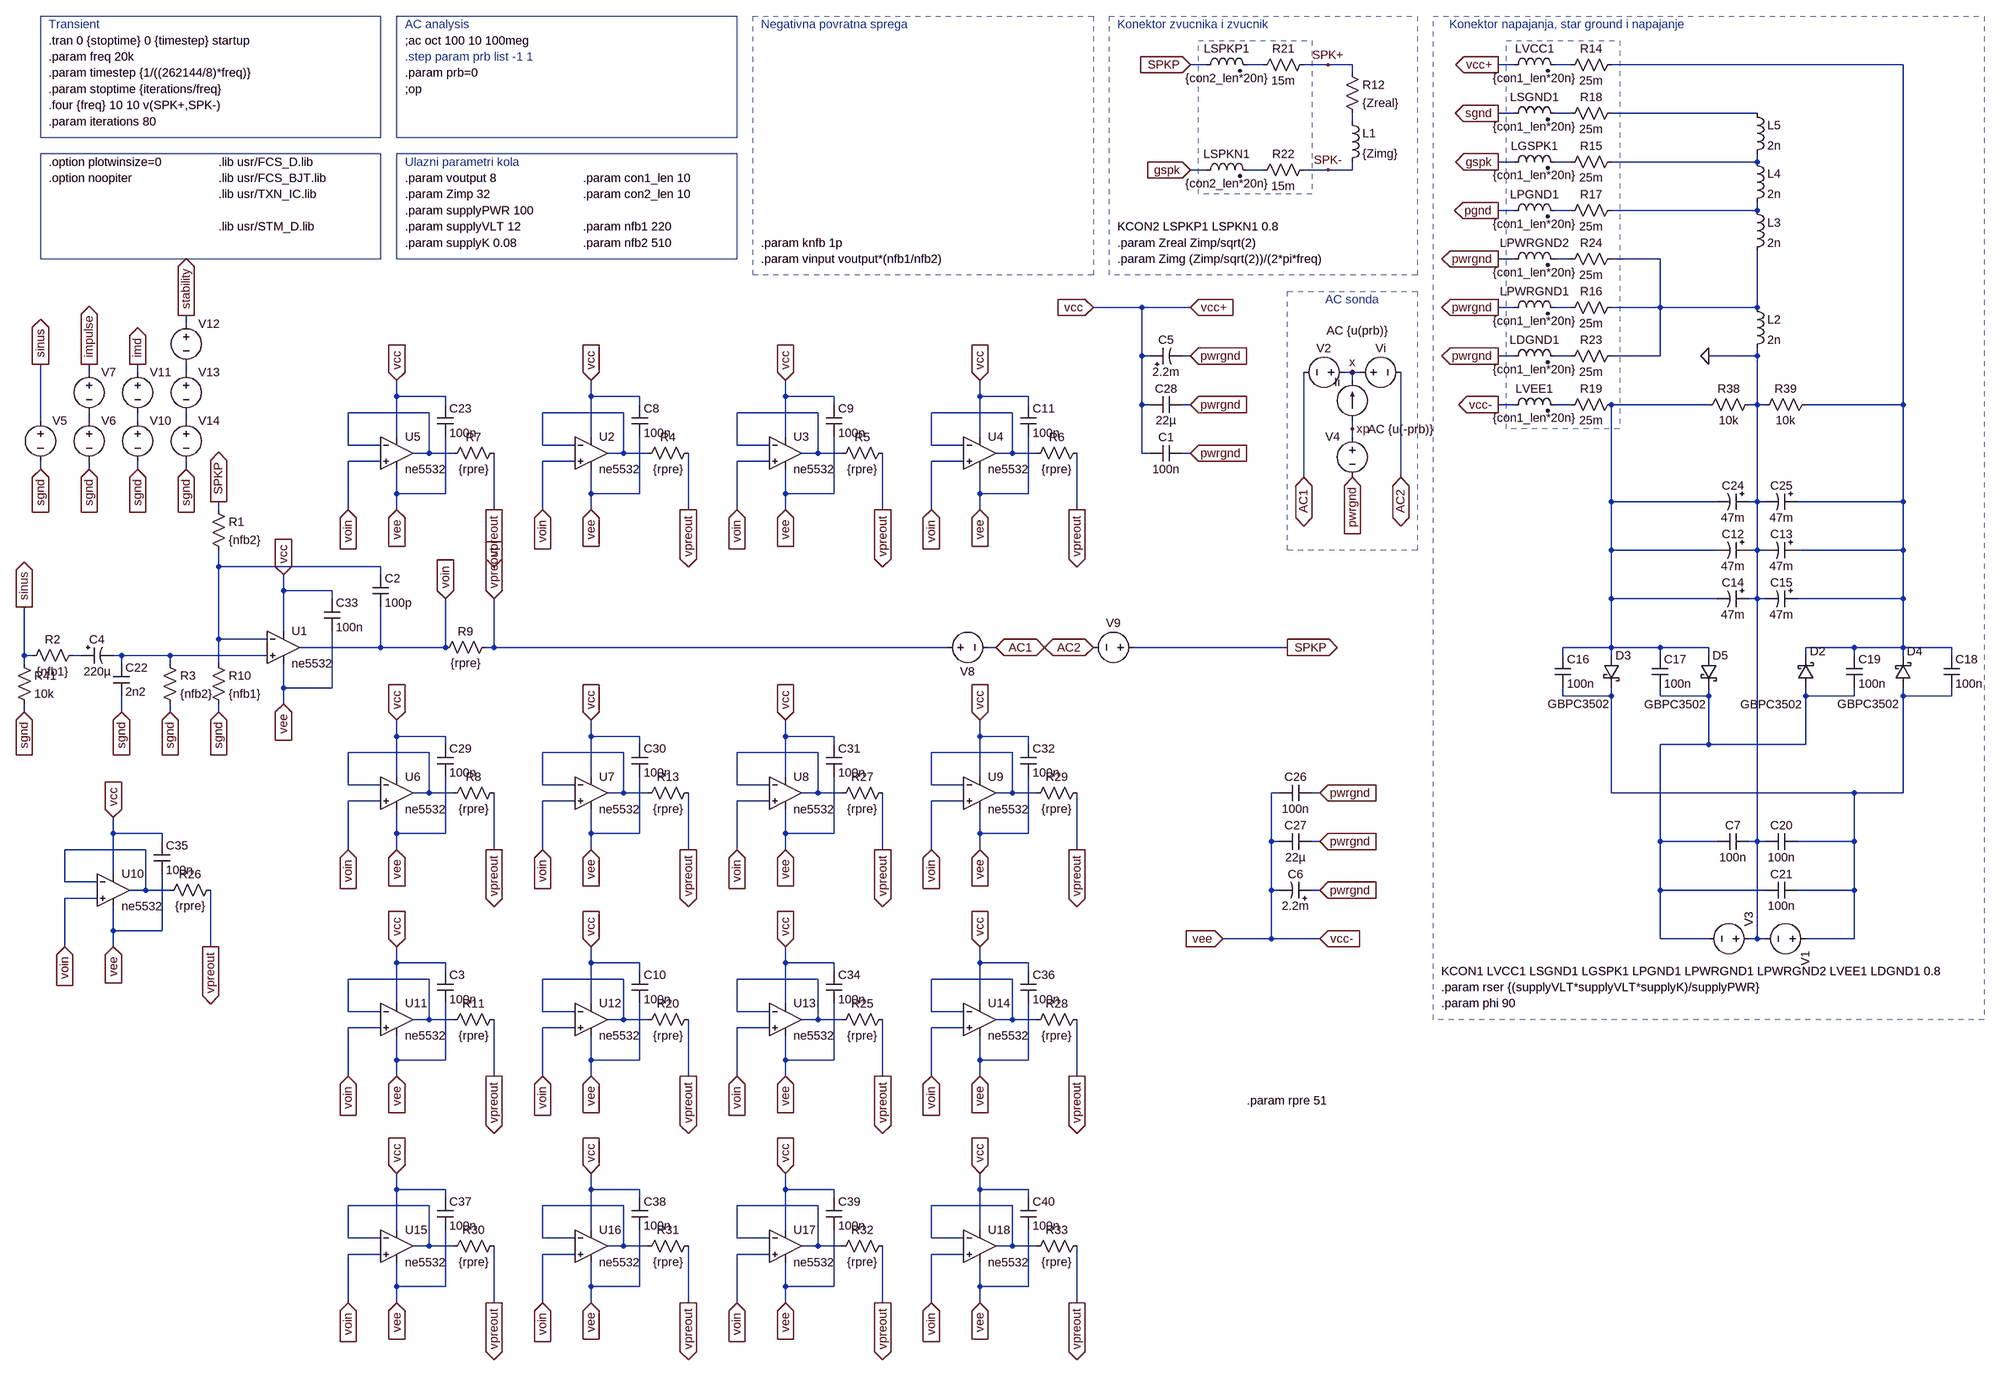
[diagram p0: schematic micro.asc]
micro.asc, the LTspice schematic file:
Version 4
SHEET 1 3028 3024
WIRE 1440 288 1408 288
WIRE 1552 288 1520 288
WIRE 1680 288 1632 288
WIRE 1728 288 1680 288
WIRE 2048 288 2016 288
WIRE 2160 288 2128 288
WIRE 2816 288 2240 288
WIRE 1728 304 1728 288
WIRE 2048 384 2016 384
WIRE 2160 384 2128 384
WIRE 2528 384 2240 384
WIRE 1728 400 1728 384
WIRE 2048 480 2016 480
WIRE 2160 480 2128 480
WIRE 2528 480 2528 464
WIRE 2528 480 2240 480
WIRE 1440 496 1408 496
WIRE 1552 496 1520 496
WIRE 1680 496 1632 496
WIRE 1728 496 1728 480
WIRE 1728 496 1680 496
WIRE 2048 576 2016 576
WIRE 2160 576 2128 576
WIRE 2528 576 2528 560
WIRE 2528 576 2240 576
WIRE 2048 672 2016 672
WIRE 2160 672 2128 672
WIRE 2336 672 2240 672
WIRE 1312 768 1216 768
WIRE 1408 768 1312 768
WIRE 2048 768 2016 768
WIRE 2160 768 2128 768
WIRE 2336 768 2336 672
WIRE 2336 768 2240 768
WIRE 2528 768 2528 656
WIRE 2528 768 2336 768
WIRE -576 800 -576 784
WIRE 1312 864 1312 768
WIRE 1328 864 1312 864
WIRE 1408 864 1392 864
WIRE 2048 864 2016 864
WIRE 2160 864 2128 864
WIRE 2336 864 2336 768
WIRE 2336 864 2240 864
WIRE 2528 864 2528 848
WIRE 2528 864 2432 864
WIRE -768 896 -768 880
WIRE -672 896 -672 880
WIRE -576 896 -576 880
WIRE 1728 896 1712 896
WIRE 1744 896 1728 896
WIRE 1728 912 1728 896
WIRE -160 944 -160 912
WIRE -64 944 -160 944
WIRE 224 944 224 912
WIRE 320 944 224 944
WIRE 608 944 608 912
WIRE 704 944 608 944
WIRE 992 944 992 912
WIRE 1088 944 992 944
WIRE -64 960 -64 944
WIRE 320 960 320 944
WIRE 704 960 704 944
WIRE 1088 960 1088 944
WIRE 1312 960 1312 864
WIRE 1328 960 1312 960
WIRE 1408 960 1392 960
WIRE 2048 960 2016 960
WIRE 2160 960 2128 960
WIRE 2432 960 2240 960
WIRE 2528 960 2528 864
WIRE 2528 960 2512 960
WIRE 2544 960 2528 960
WIRE 2816 960 2816 288
WIRE 2816 960 2624 960
WIRE -96 976 -256 976
WIRE 288 976 128 976
WIRE 672 976 512 976
WIRE 1056 976 896 976
WIRE -864 992 -864 880
WIRE -768 992 -768 976
WIRE -672 992 -672 976
WIRE -576 992 -576 976
WIRE 1728 1008 1728 992
WIRE -160 1024 -160 944
WIRE 224 1024 224 944
WIRE 608 1024 608 944
WIRE 992 1024 992 944
WIRE 1728 1024 1728 1008
WIRE -256 1040 -256 976
WIRE -192 1040 -256 1040
WIRE 128 1040 128 976
WIRE 192 1040 128 1040
WIRE 512 1040 512 976
WIRE 576 1040 512 1040
WIRE 896 1040 896 976
WIRE 960 1040 896 1040
WIRE -96 1056 -96 976
WIRE -96 1056 -128 1056
WIRE -48 1056 -96 1056
WIRE 288 1056 288 976
WIRE 288 1056 256 1056
WIRE 336 1056 288 1056
WIRE 672 1056 672 976
WIRE 672 1056 640 1056
WIRE 720 1056 672 1056
WIRE 1056 1056 1056 976
WIRE 1056 1056 1024 1056
WIRE 1104 1056 1056 1056
WIRE 1312 1056 1312 960
WIRE 1328 1056 1312 1056
WIRE 1408 1056 1392 1056
WIRE -192 1072 -256 1072
WIRE 192 1072 128 1072
WIRE 576 1072 512 1072
WIRE 960 1072 896 1072
WIRE -864 1088 -864 1072
WIRE -768 1088 -768 1072
WIRE -672 1088 -672 1072
WIRE -576 1088 -576 1072
WIRE 1632 1104 1632 896
WIRE 1824 1104 1824 896
WIRE -160 1136 -160 1088
WIRE -64 1136 -64 1024
WIRE -64 1136 -160 1136
WIRE 224 1136 224 1088
WIRE 320 1136 320 1024
WIRE 320 1136 224 1136
WIRE 608 1136 608 1088
WIRE 704 1136 704 1024
WIRE 704 1136 608 1136
WIRE 992 1136 992 1088
WIRE 1088 1136 1088 1024
WIRE 1088 1136 992 1136
WIRE 2240 1152 2240 960
WIRE 2448 1152 2240 1152
WIRE 2528 1152 2528 960
WIRE 2528 1152 2512 1152
WIRE 2544 1152 2528 1152
WIRE 2816 1152 2816 960
WIRE 2816 1152 2608 1152
WIRE -512 1168 -512 1152
WIRE -256 1168 -256 1072
WIRE -160 1168 -160 1136
WIRE 32 1168 32 1056
WIRE 128 1168 128 1072
WIRE 224 1168 224 1136
WIRE 416 1168 416 1056
WIRE 512 1168 512 1072
WIRE 608 1168 608 1136
WIRE 800 1168 800 1056
WIRE 896 1168 896 1072
WIRE 992 1168 992 1136
WIRE 1184 1168 1184 1056
WIRE 2240 1248 2240 1152
WIRE 2448 1248 2240 1248
WIRE 2528 1248 2528 1152
WIRE 2528 1248 2512 1248
WIRE 2544 1248 2528 1248
WIRE 2816 1248 2816 1152
WIRE 2816 1248 2608 1248
WIRE -512 1280 -512 1248
WIRE -192 1280 -512 1280
WIRE -192 1296 -192 1280
WIRE -384 1328 -384 1296
WIRE -288 1328 -384 1328
WIRE -288 1344 -288 1328
WIRE 2240 1344 2240 1248
WIRE 2448 1344 2240 1344
WIRE 2528 1344 2528 1248
WIRE 2528 1344 2512 1344
WIRE 2544 1344 2528 1344
WIRE 2816 1344 2816 1248
WIRE 2816 1344 2608 1344
WIRE -384 1408 -384 1328
WIRE -512 1424 -512 1280
WIRE -416 1424 -512 1424
WIRE -192 1440 -192 1360
WIRE -192 1440 -352 1440
WIRE -64 1440 -64 1344
WIRE -64 1440 -192 1440
WIRE 32 1440 32 1344
WIRE 32 1440 16 1440
WIRE 896 1440 32 1440
WIRE 928 1440 896 1440
WIRE 1024 1440 1008 1440
WIRE 1600 1440 1296 1440
WIRE 2240 1440 2240 1344
WIRE 2240 1440 2144 1440
WIRE 2336 1440 2240 1440
WIRE 2432 1440 2336 1440
WIRE 2720 1440 2624 1440
WIRE 2816 1440 2816 1344
WIRE 2816 1440 2720 1440
WIRE 2912 1440 2816 1440
WIRE -896 1456 -896 1360
WIRE -880 1456 -896 1456
WIRE -784 1456 -800 1456
WIRE -704 1456 -720 1456
WIRE -608 1456 -704 1456
WIRE -416 1456 -608 1456
WIRE 2144 1456 2144 1440
WIRE 2240 1456 2240 1440
WIRE 2336 1456 2336 1440
WIRE 2432 1456 2432 1440
WIRE 2624 1456 2624 1440
WIRE 2720 1456 2720 1440
WIRE 2816 1456 2816 1440
WIRE 2912 1456 2912 1440
WIRE -896 1472 -896 1456
WIRE -704 1472 -704 1456
WIRE -608 1472 -608 1456
WIRE -512 1472 -512 1424
WIRE -384 1520 -384 1472
WIRE -288 1520 -288 1408
WIRE -288 1520 -384 1520
WIRE 2144 1536 2144 1520
WIRE 2240 1536 2240 1520
WIRE 2240 1536 2144 1536
WIRE 2336 1536 2336 1520
WIRE 2432 1536 2432 1520
WIRE 2432 1536 2336 1536
WIRE 2624 1536 2624 1520
WIRE 2720 1536 2720 1520
WIRE 2720 1536 2624 1536
WIRE 2816 1536 2816 1520
WIRE 2912 1536 2912 1520
WIRE 2912 1536 2816 1536
WIRE -384 1552 -384 1520
WIRE -896 1568 -896 1552
WIRE -704 1568 -704 1536
WIRE -608 1568 -608 1552
WIRE -512 1568 -512 1552
WIRE -160 1616 -160 1584
WIRE -64 1616 -160 1616
WIRE 224 1616 224 1584
WIRE 320 1616 224 1616
WIRE 608 1616 608 1584
WIRE 704 1616 608 1616
WIRE 992 1616 992 1584
WIRE 1088 1616 992 1616
WIRE -64 1632 -64 1616
WIRE 320 1632 320 1616
WIRE 704 1632 704 1616
WIRE 1088 1632 1088 1616
WIRE 2432 1632 2432 1536
WIRE 2432 1632 2336 1632
WIRE 2624 1632 2624 1536
WIRE 2624 1632 2432 1632
WIRE -96 1648 -256 1648
WIRE 288 1648 128 1648
WIRE 672 1648 512 1648
WIRE 1056 1648 896 1648
WIRE -160 1696 -160 1616
WIRE 224 1696 224 1616
WIRE 608 1696 608 1616
WIRE 992 1696 992 1616
WIRE -256 1712 -256 1648
WIRE -192 1712 -256 1712
WIRE 128 1712 128 1648
WIRE 192 1712 128 1712
WIRE 512 1712 512 1648
WIRE 576 1712 512 1712
WIRE 896 1712 896 1648
WIRE 960 1712 896 1712
WIRE -96 1728 -96 1648
WIRE -96 1728 -128 1728
WIRE -48 1728 -96 1728
WIRE 288 1728 288 1648
WIRE 288 1728 256 1728
WIRE 336 1728 288 1728
WIRE 672 1728 672 1648
WIRE 672 1728 640 1728
WIRE 720 1728 672 1728
WIRE 1056 1728 1056 1648
WIRE 1056 1728 1024 1728
WIRE 1104 1728 1056 1728
WIRE 1584 1728 1568 1728
WIRE 1664 1728 1648 1728
WIRE 2240 1728 2240 1536
WIRE 2720 1728 2240 1728
WIRE 2816 1728 2816 1536
WIRE 2816 1728 2720 1728
WIRE -192 1744 -256 1744
WIRE 192 1744 128 1744
WIRE 576 1744 512 1744
WIRE 960 1744 896 1744
WIRE -720 1808 -720 1776
WIRE -624 1808 -720 1808
WIRE -160 1808 -160 1760
WIRE -64 1808 -64 1696
WIRE -64 1808 -160 1808
WIRE 224 1808 224 1760
WIRE 320 1808 320 1696
WIRE 320 1808 224 1808
WIRE 608 1808 608 1760
WIRE 704 1808 704 1696
WIRE 704 1808 608 1808
WIRE 992 1808 992 1760
WIRE 1088 1808 1088 1696
WIRE 1088 1808 992 1808
WIRE -624 1824 -624 1808
WIRE 1568 1824 1568 1728
WIRE 1584 1824 1568 1824
WIRE 1664 1824 1648 1824
WIRE 2336 1824 2336 1632
WIRE 2448 1824 2336 1824
WIRE 2528 1824 2528 1344
WIRE 2528 1824 2512 1824
WIRE 2544 1824 2528 1824
WIRE 2720 1824 2720 1728
WIRE 2720 1824 2608 1824
WIRE -656 1840 -816 1840
WIRE -256 1840 -256 1744
WIRE -160 1840 -160 1808
WIRE 32 1840 32 1728
WIRE 128 1840 128 1744
WIRE 224 1840 224 1808
WIRE 416 1840 416 1728
WIRE 512 1840 512 1744
WIRE 608 1840 608 1808
WIRE 800 1840 800 1728
WIRE 896 1840 896 1744
WIRE 992 1840 992 1808
WIRE 1184 1840 1184 1728
WIRE -720 1888 -720 1808
WIRE -816 1904 -816 1840
WIRE -752 1904 -816 1904
WIRE -656 1920 -656 1840
WIRE -656 1920 -688 1920
WIRE -608 1920 -656 1920
WIRE 1568 1920 1568 1824
WIRE 1584 1920 1568 1920
WIRE 1664 1920 1648 1920
WIRE 2336 1920 2336 1824
WIRE 2544 1920 2336 1920
WIRE 2720 1920 2720 1824
WIRE 2720 1920 2608 1920
WIRE -752 1936 -816 1936
WIRE -720 2000 -720 1952
WIRE -624 2000 -624 1888
WIRE -624 2000 -720 2000
WIRE 1568 2016 1568 1920
WIRE 1568 2016 1472 2016
WIRE 1664 2016 1568 2016
WIRE 2336 2016 2336 1920
WIRE 2432 2016 2336 2016
WIRE 2528 2016 2528 1824
WIRE 2528 2016 2512 2016
WIRE 2544 2016 2528 2016
WIRE 2720 2016 2720 1920
WIRE 2720 2016 2624 2016
WIRE -816 2032 -816 1936
WIRE -720 2032 -720 2000
WIRE -528 2032 -528 1920
WIRE -160 2064 -160 2032
WIRE -64 2064 -160 2064
WIRE 224 2064 224 2032
WIRE 320 2064 224 2064
WIRE 608 2064 608 2032
WIRE 704 2064 608 2064
WIRE 992 2064 992 2032
WIRE 1088 2064 992 2064
WIRE -64 2080 -64 2064
WIRE 320 2080 320 2064
WIRE 704 2080 704 2064
WIRE 1088 2080 1088 2064
WIRE -96 2096 -256 2096
WIRE 288 2096 128 2096
WIRE 672 2096 512 2096
WIRE 1056 2096 896 2096
WIRE -160 2144 -160 2064
WIRE 224 2144 224 2064
WIRE 608 2144 608 2064
WIRE 992 2144 992 2064
WIRE -256 2160 -256 2096
WIRE -192 2160 -256 2160
WIRE 128 2160 128 2096
WIRE 192 2160 128 2160
WIRE 512 2160 512 2096
WIRE 576 2160 512 2160
WIRE 896 2160 896 2096
WIRE 960 2160 896 2160
WIRE -96 2176 -96 2096
WIRE -96 2176 -128 2176
WIRE -48 2176 -96 2176
WIRE 288 2176 288 2096
WIRE 288 2176 256 2176
WIRE 336 2176 288 2176
WIRE 672 2176 672 2096
WIRE 672 2176 640 2176
WIRE 720 2176 672 2176
WIRE 1056 2176 1056 2096
WIRE 1056 2176 1024 2176
WIRE 1104 2176 1056 2176
WIRE -192 2192 -256 2192
WIRE 192 2192 128 2192
WIRE 576 2192 512 2192
WIRE 960 2192 896 2192
WIRE -160 2256 -160 2208
WIRE -64 2256 -64 2144
WIRE -64 2256 -160 2256
WIRE 224 2256 224 2208
WIRE 320 2256 320 2144
WIRE 320 2256 224 2256
WIRE 608 2256 608 2208
WIRE 704 2256 704 2144
WIRE 704 2256 608 2256
WIRE 992 2256 992 2208
WIRE 1088 2256 1088 2144
WIRE 1088 2256 992 2256
WIRE -256 2288 -256 2192
WIRE -160 2288 -160 2256
WIRE 32 2288 32 2176
WIRE 128 2288 128 2192
WIRE 224 2288 224 2256
WIRE 416 2288 416 2176
WIRE 512 2288 512 2192
WIRE 608 2288 608 2256
WIRE 800 2288 800 2176
WIRE 896 2288 896 2192
WIRE 992 2288 992 2256
WIRE 1184 2288 1184 2176
WIRE -160 2512 -160 2480
WIRE -64 2512 -160 2512
WIRE 224 2512 224 2480
WIRE 320 2512 224 2512
WIRE 608 2512 608 2480
WIRE 704 2512 608 2512
WIRE 992 2512 992 2480
WIRE 1088 2512 992 2512
WIRE -64 2528 -64 2512
WIRE 320 2528 320 2512
WIRE 704 2528 704 2512
WIRE 1088 2528 1088 2512
WIRE -96 2544 -256 2544
WIRE 288 2544 128 2544
WIRE 672 2544 512 2544
WIRE 1056 2544 896 2544
WIRE -160 2592 -160 2512
WIRE 224 2592 224 2512
WIRE 608 2592 608 2512
WIRE 992 2592 992 2512
WIRE -256 2608 -256 2544
WIRE -192 2608 -256 2608
WIRE 128 2608 128 2544
WIRE 192 2608 128 2608
WIRE 512 2608 512 2544
WIRE 576 2608 512 2608
WIRE 896 2608 896 2544
WIRE 960 2608 896 2608
WIRE -96 2624 -96 2544
WIRE -96 2624 -128 2624
WIRE -48 2624 -96 2624
WIRE 288 2624 288 2544
WIRE 288 2624 256 2624
WIRE 336 2624 288 2624
WIRE 672 2624 672 2544
WIRE 672 2624 640 2624
WIRE 720 2624 672 2624
WIRE 1056 2624 1056 2544
WIRE 1056 2624 1024 2624
WIRE 1104 2624 1056 2624
WIRE -192 2640 -256 2640
WIRE 192 2640 128 2640
WIRE 576 2640 512 2640
WIRE 960 2640 896 2640
WIRE -160 2704 -160 2656
WIRE -64 2704 -64 2592
WIRE -64 2704 -160 2704
WIRE 224 2704 224 2656
WIRE 320 2704 320 2592
WIRE 320 2704 224 2704
WIRE 608 2704 608 2656
WIRE 704 2704 704 2592
WIRE 704 2704 608 2704
WIRE 992 2704 992 2656
WIRE 1088 2704 1088 2592
WIRE 1088 2704 992 2704
WIRE -256 2736 -256 2640
WIRE -160 2736 -160 2704
WIRE 32 2736 32 2624
WIRE 128 2736 128 2640
WIRE 224 2736 224 2704
WIRE 416 2736 416 2624
WIRE 512 2736 512 2640
WIRE 608 2736 608 2704
WIRE 800 2736 800 2624
WIRE 896 2736 896 2640
WIRE 992 2736 992 2704
WIRE 1184 2736 1184 2624
FLAG 1408 768 vcc+
IOPIN 1408 768 In
FLAG 1728 896 x
FLAG 1664 2016 vcc-
IOPIN 1664 2016 In
FLAG 1728 1008 xp
FLAG -704 1568 sgnd
IOPIN -704 1568 In
FLAG -608 1568 sgnd
IOPIN -608 1568 In
FLAG 1408 864 pwrgnd
IOPIN 1408 864 In
FLAG -864 1088 sgnd
IOPIN -864 1088 In
FLAG -864 880 sinus
IOPIN -864 880 Out
FLAG 1664 1920 pwrgnd
IOPIN 1664 1920 In
FLAG 2016 288 vcc+
IOPIN 2016 288 Out
FLAG 2016 960 vcc-
IOPIN 2016 960 Out
FLAG 2016 480 gspk
IOPIN 2016 480 Out
FLAG 2016 768 pwrgnd
IOPIN 2016 768 Out
FLAG 2016 576 pgnd
IOPIN 2016 576 Out
FLAG 2016 384 sgnd
IOPIN 2016 384 Out
FLAG 1600 1440 SPKP
IOPIN 1600 1440 Out
FLAG 1408 496 gspk
IOPIN 1408 496 In
FLAG 1408 288 SPKP
IOPIN 1408 288 In
FLAG 2016 672 pwrgnd
IOPIN 2016 672 Out
FLAG -768 880 impulse
IOPIN -768 880 Out
FLAG 2016 864 pwrgnd
IOPIN 2016 864 Out
FLAG 2432 864 0
FLAG 1632 1104 AC1
IOPIN 1632 1104 BiDir
FLAG 1824 1104 AC2
IOPIN 1824 1104 BiDir
FLAG 1024 1440 AC1
IOPIN 1024 1440 BiDir
FLAG 1216 1440 AC2
IOPIN 1216 1440 BiDir
FLAG 1728 1104 pwrgnd
IOPIN 1728 1104 In
FLAG 1680 288 SPK+
FLAG 1680 496 SPK-
FLAG -672 880 imd
IOPIN -672 880 Out
FLAG 1408 1056 pwrgnd
IOPIN 1408 1056 In
FLAG 1664 1728 pwrgnd
IOPIN 1664 1728 In
FLAG -768 1088 sgnd
IOPIN -768 1088 In
FLAG -672 1088 sgnd
IOPIN -672 1088 In
FLAG -896 1568 sgnd
IOPIN -896 1568 In
FLAG 1664 1824 pwrgnd
IOPIN 1664 1824 In
FLAG 1408 960 pwrgnd
IOPIN 1408 960 In
FLAG -576 784 stability
IOPIN -576 784 Out
FLAG -576 1088 sgnd
IOPIN -576 1088 In
FLAG 1216 768 vcc
IOPIN 1216 768 In
FLAG 1472 2016 vee
IOPIN 1472 2016 In
FLAG -160 912 vcc
IOPIN -160 912 In
FLAG -160 1168 vee
IOPIN -160 1168 In
FLAG -256 1168 voin
IOPIN -256 1168 In
FLAG 32 1168 vpreout
IOPIN 32 1168 Out
FLAG 32 1344 vpreout
IOPIN 32 1344 In
FLAG -64 1344 voin
IOPIN -64 1344 In
FLAG -384 1296 vcc
IOPIN -384 1296 In
FLAG -384 1552 vee
IOPIN -384 1552 In
FLAG 224 912 vcc
IOPIN 224 912 In
FLAG 224 1168 vee
IOPIN 224 1168 In
FLAG 128 1168 voin
IOPIN 128 1168 In
FLAG 416 1168 vpreout
IOPIN 416 1168 Out
FLAG 608 912 vcc
IOPIN 608 912 In
FLAG 608 1168 vee
IOPIN 608 1168 In
FLAG 512 1168 voin
IOPIN 512 1168 In
FLAG 800 1168 vpreout
IOPIN 800 1168 Out
FLAG 992 912 vcc
IOPIN 992 912 In
FLAG 992 1168 vee
IOPIN 992 1168 In
FLAG 896 1168 voin
IOPIN 896 1168 In
FLAG 1184 1168 vpreout
IOPIN 1184 1168 Out
FLAG -160 1584 vcc
IOPIN -160 1584 In
FLAG -160 1840 vee
IOPIN -160 1840 In
FLAG -256 1840 voin
IOPIN -256 1840 In
FLAG 32 1840 vpreout
IOPIN 32 1840 Out
FLAG 224 1584 vcc
IOPIN 224 1584 In
FLAG 224 1840 vee
IOPIN 224 1840 In
FLAG 128 1840 voin
IOPIN 128 1840 In
FLAG 416 1840 vpreout
IOPIN 416 1840 Out
FLAG 608 1584 vcc
IOPIN 608 1584 In
FLAG 608 1840 vee
IOPIN 608 1840 In
FLAG 512 1840 voin
IOPIN 512 1840 In
FLAG 800 1840 vpreout
IOPIN 800 1840 Out
FLAG 992 1584 vcc
IOPIN 992 1584 In
FLAG 992 1840 vee
IOPIN 992 1840 In
FLAG 896 1840 voin
IOPIN 896 1840 In
FLAG 1184 1840 vpreout
IOPIN 1184 1840 Out
FLAG -720 1776 vcc
IOPIN -720 1776 In
FLAG -720 2032 vee
IOPIN -720 2032 In
FLAG -816 2032 voin
IOPIN -816 2032 In
FLAG -528 2032 vpreout
IOPIN -528 2032 Out
FLAG -512 1568 sgnd
IOPIN -512 1568 In
FLAG -512 1152 SPKP
IOPIN -512 1152 Out
FLAG -160 2032 vcc
IOPIN -160 2032 In
FLAG -160 2288 vee
IOPIN -160 2288 In
FLAG -256 2288 voin
IOPIN -256 2288 In
FLAG 32 2288 vpreout
IOPIN 32 2288 Out
FLAG 224 2032 vcc
IOPIN 224 2032 In
FLAG 224 2288 vee
IOPIN 224 2288 In
FLAG 128 2288 voin
IOPIN 128 2288 In
FLAG 416 2288 vpreout
IOPIN 416 2288 Out
FLAG 608 2032 vcc
IOPIN 608 2032 In
FLAG 608 2288 vee
IOPIN 608 2288 In
FLAG 512 2288 voin
IOPIN 512 2288 In
FLAG 800 2288 vpreout
IOPIN 800 2288 Out
FLAG 992 2032 vcc
IOPIN 992 2032 In
FLAG 992 2288 vee
IOPIN 992 2288 In
FLAG 896 2288 voin
IOPIN 896 2288 In
FLAG 1184 2288 vpreout
IOPIN 1184 2288 Out
FLAG -160 2480 vcc
IOPIN -160 2480 In
FLAG -160 2736 vee
IOPIN -160 2736 In
FLAG -256 2736 voin
IOPIN -256 2736 In
FLAG 32 2736 vpreout
IOPIN 32 2736 Out
FLAG 224 2480 vcc
IOPIN 224 2480 In
FLAG 224 2736 vee
IOPIN 224 2736 In
FLAG 128 2736 voin
IOPIN 128 2736 In
FLAG 416 2736 vpreout
IOPIN 416 2736 Out
FLAG 608 2480 vcc
IOPIN 608 2480 In
FLAG 608 2736 vee
IOPIN 608 2736 In
FLAG 512 2736 voin
IOPIN 512 2736 In
FLAG 800 2736 vpreout
IOPIN 800 2736 Out
FLAG 992 2480 vcc
IOPIN 992 2480 In
FLAG 992 2736 vee
IOPIN 992 2736 In
FLAG 896 2736 voin
IOPIN 896 2736 In
FLAG 1184 2736 vpreout
IOPIN 1184 2736 Out
FLAG -896 1360 sinus
IOPIN -896 1360 Out
DATAFLAG 1312 768 ""
DATAFLAG 1568 2016 ""
DATAFLAG 896 1440 ""
SYMBOL voltage 2640 2016 R90
WINDOW 123 0 0 Left 2
WINDOW 3 -94 177 Invisible 2
SYMATTR Value SINE(0 {supplyVLT*sqrt(2)*(supplyK+1)} 50 1m 0 {phi})
SYMATTR SpiceLine Rser={rser}
SYMATTR InstName V1
SYMBOL current 1728 992 R180
WINDOW 0 24 77 Left 2
WINDOW 3 24 0 Invisible 2
WINDOW 123 -71 178 Left 2
WINDOW 39 0 0 Left 2
SYMATTR InstName Ii
SYMATTR Value 0
SYMATTR Value2 AC {u(prb)}
SYMBOL voltage 1728 896 R270
WINDOW 0 32 56 VTop 2
WINDOW 3 -32 56 Invisible 2
WINDOW 123 -97 96 VBottom 2
WINDOW 39 -32 56 VBottom 2
SYMATTR InstName Vi
SYMATTR Value 0
SYMATTR Value2 AC {u(-prb)}
SYMBOL res -784 1440 R90
WINDOW 0 0 56 VBottom 2
WINDOW 3 32 56 VTop 2
SYMATTR InstName R2
SYMATTR Value {nfb1}
SYMBOL res -624 1456 R0
SYMATTR InstName R3
SYMATTR Value {nfb2}
SYMBOL voltage 1728 896 R90
WINDOW 0 -32 56 VBottom 2
WINDOW 3 32 56 Invisible 2
WINDOW 123 0 0 Left 2
WINDOW 39 0 0 Left 2
SYMATTR InstName V2
SYMATTR Value 0
SYMBOL voltage 2528 2016 M270
WINDOW 123 24 -12 Left 2
WINDOW 3 -96 -62 Invisible 2
SYMATTR Value SINE(0 {supplyVLT*sqrt(2)*(supplyK+1)} 50 1m 0 {phi})
SYMATTR SpiceLine Rser={rser}
SYMATTR InstName V3
SYMBOL res 1712 288 R0
SYMATTR InstName R12
SYMATTR Value {Zreal}
SYMBOL ind 1712 384 R0
SYMATTR InstName L1
SYMATTR Value {Zimg}
SYMATTR SpiceLine Cpar=10p
SYMBOL voltage 1728 1008 M0
WINDOW 123 0 0 Left 2
WINDOW 39 0 0 Left 2
WINDOW 3 24 96 Invisible 2
SYMATTR Value 0
SYMATTR InstName V4
SYMBOL cap 1328 1040 M90
WINDOW 0 0 32 VBottom 2
WINDOW 3 32 32 VTop 2
SYMATTR InstName C1
SYMATTR Value 100n
SYMATTR SpiceLine Rser=300m Lser=3n Rpar=4.4meg Cpar=1p
SYMBOL ind2 2032 304 R270
WINDOW 0 32 56 VTop 2
WINDOW 3 5 56 VBottom 2
SYMATTR InstName LVCC1
SYMATTR Value {con1_len*20n}
SYMATTR SpiceLine Rser={con1_len*.5m}
SYMATTR Type ind
SYMBOL ind2 2032 976 R270
WINDOW 0 32 56 VTop 2
WINDOW 3 5 56 VBottom 2
SYMATTR InstName LVEE1
SYMATTR Value {con1_len*20n}
SYMATTR SpiceLine Rser={con1_len*.5m}
SYMATTR Type ind
SYMBOL voltage -864 976 R0
WINDOW 123 24 44 Left 2
WINDOW 39 0 0 Left 2
WINDOW 3 24 96 Invisible 2
SYMATTR Value SINE(0 {vinput} {freq} 0 0 0)
SYMATTR InstName V5
SYMBOL ind2 2032 496 R270
WINDOW 0 32 56 VTop 2
WINDOW 3 5 56 VBottom 2
SYMATTR InstName LGSPK1
SYMATTR Value {con1_len*20n}
SYMATTR SpiceLine Rser={con1_len*.5m}
SYMATTR Type ind
SYMBOL ind2 2032 784 R270
WINDOW 0 32 56 VTop 2
WINDOW 3 5 56 VBottom 2
SYMATTR InstName LPWRGND1
SYMATTR Value {con1_len*20n}
SYMATTR SpiceLine Rser={con1_len*.5m}
SYMATTR Type ind
SYMBOL ind2 2032 592 R270
WINDOW 0 32 56 VTop 2
WINDOW 3 5 56 VBottom 2
SYMATTR InstName LPGND1
SYMATTR Value {con1_len*20n}
SYMATTR SpiceLine Rser={con1_len*.5m}
SYMATTR Type ind
SYMBOL ind2 2032 400 R270
WINDOW 0 32 56 VTop 2
WINDOW 3 5 56 VBottom 2
SYMATTR InstName LSGND1
SYMATTR Value {con1_len*20n}
SYMATTR SpiceLine Rser={con1_len*.5m}
SYMATTR Type ind
SYMBOL res 2256 272 R90
WINDOW 0 0 56 VBottom 2
WINDOW 3 32 56 VTop 2
SYMATTR InstName R14
SYMATTR Value 25m
SYMBOL res 2256 464 R90
WINDOW 0 0 56 VBottom 2
WINDOW 3 32 56 VTop 2
SYMATTR InstName R15
SYMATTR Value 25m
SYMBOL res 2256 752 R90
WINDOW 0 0 56 VBottom 2
WINDOW 3 32 56 VTop 2
SYMATTR InstName R16
SYMATTR Value 25m
SYMBOL res 2256 560 R90
WINDOW 0 0 56 VBottom 2
WINDOW 3 32 56 VTop 2
SYMATTR InstName R17
SYMATTR Value 25m
SYMBOL res 2256 368 R90
WINDOW 0 0 56 VBottom 2
WINDOW 3 32 56 VTop 2
SYMATTR InstName R18
SYMATTR Value 25m
SYMBOL res 2256 944 R90
WINDOW 0 0 56 VBottom 2
WINDOW 3 32 56 VTop 2
SYMATTR InstName R19
SYMATTR Value 25m
SYMBOL ind 2512 752 R0
SYMATTR InstName L2
SYMATTR Value 2n
SYMATTR SpiceLine Rser=1m
SYMBOL ind 2512 560 R0
SYMATTR InstName L3
SYMATTR Value 2n
SYMATTR SpiceLine Rser=1m
SYMBOL ind 2512 464 R0
SYMATTR InstName L4
SYMATTR Value 2n
SYMATTR SpiceLine Rser=1m
SYMBOL ind 2512 368 R0
SYMATTR InstName L5
SYMATTR Value 2n
SYMATTR SpiceLine Rser=1m
SYMBOL ind2 1424 304 R270
WINDOW 0 32 56 VTop 2
WINDOW 3 5 56 VBottom 2
SYMATTR InstName LSPKP1
SYMATTR Value {con2_len*20n}
SYMATTR SpiceLine Rser={con2_len*.5m}
SYMATTR Type ind
SYMBOL ind2 1424 512 R270
WINDOW 0 32 56 VTop 2
WINDOW 3 5 56 VBottom 2
SYMATTR InstName LSPKN1
SYMATTR Value {con2_len*20n}
SYMATTR SpiceLine Rser={con2_len*.5m}
SYMATTR Type ind
SYMBOL res 1648 272 R90
WINDOW 0 0 56 VBottom 2
WINDOW 3 32 56 VTop 2
SYMATTR InstName R21
SYMATTR Value 15m
SYMBOL res 1648 480 R90
WINDOW 0 0 56 VBottom 2
WINDOW 3 32 56 VTop 2
SYMATTR InstName R22
SYMATTR Value 15m
SYMBOL ind2 2032 880 R270
WINDOW 0 32 56 VTop 2
WINDOW 3 5 56 VBottom 2
SYMATTR InstName LDGND1
SYMATTR Value {con1_len*20n}
SYMATTR SpiceLine Rser={con1_len*.5m}
SYMATTR Type ind
SYMBOL res 2256 848 R90
WINDOW 0 0 56 VBottom 2
WINDOW 3 32 56 VTop 2
SYMATTR InstName R23
SYMATTR Value 25m
SYMBOL ind2 2032 688 R270
WINDOW 0 32 56 VTop 2
WINDOW 3 5 56 VBottom 2
SYMATTR InstName LPWRGND2
SYMATTR Value {con1_len*20n}
SYMATTR SpiceLine Rser={con1_len*.5m}
SYMATTR Type ind
SYMBOL res 2256 656 R90
WINDOW 0 0 56 VBottom 2
WINDOW 3 32 56 VTop 2
SYMATTR InstName R24
SYMATTR Value 25m
SYMBOL voltage -768 976 R0
WINDOW 3 24 96 Invisible 2
WINDOW 123 0 0 Left 2
WINDOW 39 0 0 Left 2
SYMATTR Value PULSE(0 {vinput/2} 1u 1n 1n {1/(freq*2)} {1/freq})
SYMATTR InstName V6
SYMBOL voltage -768 880 R0
WINDOW 3 24 96 Invisible 2
WINDOW 123 0 0 Left 2
WINDOW 39 0 0 Left 2
SYMATTR Value PULSE(0 {-vinput/2} {1u+(1/(freq*2))} 1n 1n {1/(freq*2)} {1/freq})
SYMATTR InstName V7
SYMBOL polcap -784 1440 M90
WINDOW 3 32 32 VTop 2
WINDOW 0 0 32 VBottom 2
SYMATTR Value 220µ
SYMATTR InstName C4
SYMATTR SpiceLine V=6.3 Irms=290m Rser=0.5 Lser=3n Rpar=2100k Cpar=3p mfg="Nichicon" pn="UPW0J221MED1TD" type="Al electrolytic"
SYMATTR Description Capacitor
SYMATTR Type cap
SYMBOL polcap 1328 880 R270
WINDOW 0 32 32 VTop 2
WINDOW 3 0 32 VBottom 2
SYMATTR InstName C5
SYMATTR Value 2.2m
SYMATTR SpiceLine V=63 Irms=2.77 Rser=0.036 Lser=12n Rpar=900k Cpar=3p
SYMATTR Description Capacitor
SYMATTR Type cap
SYMBOL polcap 1648 1936 M270
WINDOW 0 32 32 VTop 2
WINDOW 3 0 32 VBottom 2
SYMATTR InstName C6
SYMATTR Value 2.2m
SYMATTR SpiceLine V=63 Irms=2.77 Rser=0.038 Lser=12n Rpar=800k Cpar=3p
SYMATTR Description Capacitor
SYMATTR Type cap
SYMBOL voltage 912 1440 R270
WINDOW 0 -32 56 VBottom 2
WINDOW 3 32 56 Invisible 2
WINDOW 123 0 0 Left 2
WINDOW 39 0 0 Left 2
SYMATTR InstName V8
SYMATTR Value 0
SYMBOL voltage 1312 1440 R90
WINDOW 0 -32 56 VBottom 2
WINDOW 3 32 56 Invisible 2
WINDOW 123 0 0 Left 2
WINDOW 39 0 0 Left 2
SYMATTR InstName V9
SYMATTR Value 0
SYMBOL voltage -672 976 R0
WINDOW 3 24 96 Invisible 2
WINDOW 123 0 0 Left 2
WINDOW 39 0 0 Left 2
SYMATTR Value SINE(0 {vinput/2} 19k)
SYMATTR InstName V10
SYMBOL voltage -672 880 R0
WINDOW 3 24 96 Invisible 2
WINDOW 123 0 0 Left 2
WINDOW 39 0 0 Left 2
SYMATTR Value SINE(0 {vinput/2} 20k 0 0)
SYMATTR InstName V11
SYMBOL cap 2448 1808 M90
WINDOW 0 0 32 VBottom 2
WINDOW 3 32 32 VTop 2
SYMATTR InstName C7
SYMATTR Value 100n
SYMATTR SpiceLine Rser=700m Lser=7n Rpar=4.4meg Cpar=1p
SYMBOL polcap 2512 1232 R90
WINDOW 0 0 32 VBottom 2
WINDOW 3 32 32 VTop 2
SYMATTR InstName C12
SYMATTR Value 47m
SYMATTR SpiceLine V=50 Irms=2.5 Rser=0.024 Lser=89n Rpar=40k Cpar=3p
SYMATTR Description Capacitor
SYMATTR Type cap
SYMBOL polcap 2608 1232 R90
WINDOW 0 0 32 VBottom 2
WINDOW 3 32 32 VTop 2
SYMATTR InstName C13
SYMATTR Value 47m
SYMATTR SpiceLine V=50 Irms=2.5 Rser=0.024 Lser=85n Rpar=40k Cpar=3p
SYMATTR Description Capacitor
SYMATTR Type cap
SYMBOL res 2528 944 R90
WINDOW 0 0 56 VBottom 2
WINDOW 3 32 56 VTop 2
SYMATTR InstName R38
SYMATTR Value 10k
SYMBOL res 2640 944 R90
WINDOW 0 0 56 VBottom 2
WINDOW 3 32 56 VTop 2
SYMATTR InstName R39
SYMATTR Value 10k
SYMBOL polcap 2512 1328 R90
WINDOW 0 0 32 VBottom 2
WINDOW 3 32 32 VTop 2
SYMATTR InstName C14
SYMATTR Value 47m
SYMATTR SpiceLine V=50 Irms=2.5 Rser=0.024 Lser=89n Rpar=40k Cpar=3p
SYMATTR Description Capacitor
SYMATTR Type cap
SYMBOL polcap 2608 1328 R90
WINDOW 0 0 32 VBottom 2
WINDOW 3 32 32 VTop 2
SYMATTR InstName C15
SYMATTR Value 47m
SYMATTR SpiceLine V=50 Irms=2.5 Rser=0.024 Lser=85n Rpar=40k Cpar=3p
SYMATTR Description Capacitor
SYMATTR Type cap
SYMBOL schottky 2608 1520 M180
WINDOW 0 24 72 Left 2
WINDOW 3 -113 -33 Left 2
SYMATTR InstName D2
SYMATTR Value GBPC3502
SYMATTR Description Diode
SYMATTR Type diode
SYMBOL schottky 2224 1456 R0
WINDOW 3 -110 96 Left 2
SYMATTR Value GBPC3502
SYMATTR InstName D3
SYMATTR Description Diode
SYMATTR Type diode
SYMBOL schottky 2800 1520 M180
WINDOW 0 24 72 Left 2
WINDOW 3 -114 -32 Left 2
SYMATTR InstName D4
SYMATTR Value GBPC3502
SYMATTR Description Diode
SYMATTR Type diode
SYMBOL schottky 2416 1456 R0
WINDOW 3 -111 97 Left 2
SYMATTR Value GBPC3502
SYMATTR InstName D5
SYMATTR Description Diode
SYMATTR Type diode
SYMBOL cap 2128 1456 R0
SYMATTR InstName C16
SYMATTR Value 100n
SYMATTR SpiceLine Rser=700m Lser=7n Rpar=4.4meg Cpar=1p
SYMBOL cap 2320 1456 R0
SYMATTR InstName C17
SYMATTR Value 100n
SYMATTR SpiceLine Rser=700m Lser=7n Rpar=4.4meg Cpar=1p
SYMBOL cap 2896 1456 R0
SYMATTR InstName C18
SYMATTR Value 100n
SYMATTR SpiceLine Rser=700m Lser=7n Rpar=4.4meg Cpar=1p
SYMBOL cap 2704 1456 R0
SYMATTR InstName C19
SYMATTR Value 100n
SYMATTR SpiceLine Rser=700m Lser=7n Rpar=4.4meg Cpar=1p
SYMBOL cap 2544 1808 M90
WINDOW 0 0 32 VBottom 2
WINDOW 3 32 32 VTop 2
SYMATTR InstName C20
SYMATTR Value 100n
SYMATTR SpiceLine Rser=700m Lser=7n Rpar=4.4meg Cpar=1p
SYMBOL cap 2544 1904 M90
WINDOW 0 0 32 VBottom 2
WINDOW 3 32 32 VTop 2
SYMATTR InstName C21
SYMATTR Value 100n
SYMATTR SpiceLine Rser=700m Lser=7n Rpar=4.4meg Cpar=1p
SYMBOL cap -720 1536 M180
WINDOW 0 24 56 Left 2
WINDOW 3 24 8 Left 2
SYMATTR InstName C22
SYMATTR Value 2n2
SYMATTR SpiceLine Rser=.15 Lser=5n Rpar=3meg Cpar=2p
SYMBOL res -912 1456 R0
SYMATTR InstName R41
SYMATTR Value 10k
SYMBOL polcap 2512 1136 R90
WINDOW 0 0 32 VBottom 2
WINDOW 3 32 32 VTop 2
SYMATTR InstName C24
SYMATTR Value 47m
SYMATTR SpiceLine V=50 Irms=2.5 Rser=0.024 Lser=89n Rpar=40k Cpar=3p
SYMATTR Description Capacitor
SYMATTR Type cap
SYMBOL polcap 2608 1136 R90
WINDOW 0 0 32 VBottom 2
WINDOW 3 32 32 VTop 2
SYMATTR InstName C25
SYMATTR Value 47m
SYMATTR SpiceLine V=50 Irms=2.5 Rser=0.024 Lser=85n Rpar=40k Cpar=3p
SYMATTR Description Capacitor
SYMATTR Type cap
SYMBOL cap 1584 1712 M90
WINDOW 0 0 32 VBottom 2
WINDOW 3 32 32 VTop 2
SYMATTR InstName C26
SYMATTR Value 100n
SYMATTR SpiceLine Rser=300m Lser=3n Rpar=4.4meg Cpar=1p
SYMBOL cap 1584 1808 M90
WINDOW 0 0 32 VBottom 2
WINDOW 3 32 32 VTop 2
SYMATTR InstName C27
SYMATTR Value 22µ
SYMATTR SpiceLine Rser=80m Lser=6n Rpar=4.4meg Cpar=1p
SYMBOL cap 1328 944 M90
WINDOW 0 0 32 VBottom 2
WINDOW 3 32 32 VTop 2
SYMATTR InstName C28
SYMATTR Value 22µ
SYMATTR SpiceLine Rser=80m Lser=6n Rpar=4.4meg Cpar=1p
SYMBOL voltage -576 784 R0
WINDOW 123 24 44 Left 2
WINDOW 39 0 0 Left 2
WINDOW 3 24 96 Invisible 2
SYMATTR Value SINE(0 {7*vinput/8} {freq} 0 0 0)
SYMATTR InstName V12
SYMBOL voltage -576 880 R0
WINDOW 3 24 96 Invisible 2
WINDOW 123 0 0 Left 2
WINDOW 39 0 0 Left 2
SYMATTR Value PULSE(0 {-vinput/8} {1u+(1/(freq*80))} 1n 1n {1/(freq*80)} {1/(freq*40)})
SYMATTR InstName V13
SYMBOL voltage -576 976 R0
WINDOW 3 24 96 Invisible 2
WINDOW 123 0 0 Left 2
WINDOW 39 0 0 Left 2
SYMATTR Value PULSE(0 {vinput/8} 1u 1n 1n {1/(freq*80)} {1/(freq*40)})
SYMATTR InstName V14
SYMBOL Opamps\\opamp2 -384 1376 R0
SYMATTR InstName U1
SYMATTR Value ne5532
SYMBOL Opamps\\opamp2 -160 992 R0
SYMATTR InstName U5
SYMATTR Value ne5532
SYMBOL cap -80 960 R0
SYMATTR InstName C23
SYMATTR Value 100n
SYMATTR SpiceLine Rser=300m Lser=3n Rpar=4.4meg Cpar=1p
SYMBOL res 48 1040 R90
WINDOW 0 0 56 VBottom 2
WINDOW 3 32 56 VTop 2
SYMATTR InstName R7
SYMATTR Value {rpre}
SYMBOL cap -304 1344 R0
SYMATTR InstName C33
SYMATTR Value 100n
SYMATTR SpiceLine Rser=300m Lser=3n Rpar=4.4meg Cpar=1p
SYMBOL Opamps\\opamp2 224 992 R0
SYMATTR InstName U2
SYMATTR Value ne5532
SYMBOL cap 304 960 R0
SYMATTR InstName C8
SYMATTR Value 100n
SYMATTR SpiceLine Rser=300m Lser=3n Rpar=4.4meg Cpar=1p
SYMBOL Opamps\\opamp2 608 992 R0
SYMATTR InstName U3
SYMATTR Value ne5532
SYMBOL cap 688 960 R0
SYMATTR InstName C9
SYMATTR Value 100n
SYMATTR SpiceLine Rser=300m Lser=3n Rpar=4.4meg Cpar=1p
SYMBOL Opamps\\opamp2 992 992 R0
SYMATTR InstName U4
SYMATTR Value ne5532
SYMBOL cap 1072 960 R0
SYMATTR InstName C11
SYMATTR Value 100n
SYMATTR SpiceLine Rser=300m Lser=3n Rpar=4.4meg Cpar=1p
SYMBOL Opamps\\opamp2 -160 1664 R0
SYMATTR InstName U6
SYMATTR Value ne5532
SYMBOL cap -80 1632 R0
SYMATTR InstName C29
SYMATTR Value 100n
SYMATTR SpiceLine Rser=300m Lser=3n Rpar=4.4meg Cpar=1p
SYMBOL Opamps\\opamp2 224 1664 R0
SYMATTR InstName U7
SYMATTR Value ne5532
SYMBOL cap 304 1632 R0
SYMATTR InstName C30
SYMATTR Value 100n
SYMATTR SpiceLine Rser=300m Lser=3n Rpar=4.4meg Cpar=1p
SYMBOL Opamps\\opamp2 608 1664 R0
SYMATTR InstName U8
SYMATTR Value ne5532
SYMBOL cap 688 1632 R0
SYMATTR InstName C31
SYMATTR Value 100n
SYMATTR SpiceLine Rser=300m Lser=3n Rpar=4.4meg Cpar=1p
SYMBOL Opamps\\opamp2 992 1664 R0
SYMATTR InstName U9
SYMATTR Value ne5532
SYMBOL cap 1072 1632 R0
SYMATTR InstName C32
SYMATTR Value 100n
SYMATTR SpiceLine Rser=300m Lser=3n Rpar=4.4meg Cpar=1p
SYMBOL Opamps\\opamp2 -720 1856 R0
SYMATTR InstName U10
SYMATTR Value ne5532
SYMBOL cap -640 1824 R0
SYMATTR InstName C35
SYMATTR Value 100n
SYMATTR SpiceLine Rser=300m Lser=3n Rpar=4.4meg Cpar=1p
SYMBOL res 432 1040 R90
WINDOW 0 0 56 VBottom 2
WINDOW 3 32 56 VTop 2
SYMATTR InstName R4
SYMATTR Value {rpre}
SYMBOL res 816 1040 R90
WINDOW 0 0 56 VBottom 2
WINDOW 3 32 56 VTop 2
SYMATTR InstName R5
SYMATTR Value {rpre}
SYMBOL res 1200 1040 R90
WINDOW 0 0 56 VBottom 2
WINDOW 3 32 56 VTop 2
SYMATTR InstName R6
SYMATTR Value {rpre}
SYMBOL res 48 1712 R90
WINDOW 0 0 56 VBottom 2
WINDOW 3 32 56 VTop 2
SYMATTR InstName R8
SYMATTR Value {rpre}
SYMBOL res 432 1712 R90
WINDOW 0 0 56 VBottom 2
WINDOW 3 32 56 VTop 2
SYMATTR InstName R13
SYMATTR Value {rpre}
SYMBOL res -512 1904 R90
WINDOW 0 0 56 VBottom 2
WINDOW 3 32 56 VTop 2
SYMATTR InstName R26
SYMATTR Value {rpre}
SYMBOL res 816 1712 R90
WINDOW 0 0 56 VBottom 2
WINDOW 3 32 56 VTop 2
SYMATTR InstName R27
SYMATTR Value {rpre}
SYMBOL res 1200 1712 R90
WINDOW 0 0 56 VBottom 2
WINDOW 3 32 56 VTop 2
SYMATTR InstName R29
SYMATTR Value {rpre}
SYMBOL res -528 1152 R0
SYMATTR InstName R1
SYMATTR Value {nfb2}
SYMBOL res -528 1456 R0
SYMATTR InstName R10
SYMATTR Value {nfb1}
SYMBOL cap -208 1296 R0
SYMATTR InstName C2
SYMATTR Value 100p
SYMBOL res 32 1424 R90
WINDOW 0 0 56 VBottom 2
WINDOW 3 32 56 VTop 2
SYMATTR InstName R9
SYMATTR Value {rpre}
SYMBOL Opamps\\opamp2 -160 2112 R0
SYMATTR InstName U11
SYMATTR Value ne5532
SYMBOL cap -80 2080 R0
SYMATTR InstName C3
SYMATTR Value 100n
SYMATTR SpiceLine Rser=300m Lser=3n Rpar=4.4meg Cpar=1p
SYMBOL Opamps\\opamp2 224 2112 R0
SYMATTR InstName U12
SYMATTR Value ne5532
SYMBOL cap 304 2080 R0
SYMATTR InstName C10
SYMATTR Value 100n
SYMATTR SpiceLine Rser=300m Lser=3n Rpar=4.4meg Cpar=1p
SYMBOL Opamps\\opamp2 608 2112 R0
SYMATTR InstName U13
SYMATTR Value ne5532
SYMBOL cap 688 2080 R0
SYMATTR InstName C34
SYMATTR Value 100n
SYMATTR SpiceLine Rser=300m Lser=3n Rpar=4.4meg Cpar=1p
SYMBOL Opamps\\opamp2 992 2112 R0
SYMATTR InstName U14
SYMATTR Value ne5532
SYMBOL cap 1072 2080 R0
SYMATTR InstName C36
SYMATTR Value 100n
SYMATTR SpiceLine Rser=300m Lser=3n Rpar=4.4meg Cpar=1p
SYMBOL res 48 2160 R90
WINDOW 0 0 56 VBottom 2
WINDOW 3 32 56 VTop 2
SYMATTR InstName R11
SYMATTR Value {rpre}
SYMBOL res 432 2160 R90
WINDOW 0 0 56 VBottom 2
WINDOW 3 32 56 VTop 2
SYMATTR InstName R20
SYMATTR Value {rpre}
SYMBOL res 816 2160 R90
WINDOW 0 0 56 VBottom 2
WINDOW 3 32 56 VTop 2
SYMATTR InstName R25
SYMATTR Value {rpre}
SYMBOL res 1200 2160 R90
WINDOW 0 0 56 VBottom 2
WINDOW 3 32 56 VTop 2
SYMATTR InstName R28
SYMATTR Value {rpre}
SYMBOL Opamps\\opamp2 -160 2560 R0
SYMATTR InstName U15
SYMATTR Value ne5532
SYMBOL cap -80 2528 R0
SYMATTR InstName C37
SYMATTR Value 100n
SYMATTR SpiceLine Rser=300m Lser=3n Rpar=4.4meg Cpar=1p
SYMBOL Opamps\\opamp2 224 2560 R0
SYMATTR InstName U16
SYMATTR Value ne5532
SYMBOL cap 304 2528 R0
SYMATTR InstName C38
SYMATTR Value 100n
SYMATTR SpiceLine Rser=300m Lser=3n Rpar=4.4meg Cpar=1p
SYMBOL Opamps\\opamp2 608 2560 R0
SYMATTR InstName U17
SYMATTR Value ne5532
SYMBOL cap 688 2528 R0
SYMATTR InstName C39
SYMATTR Value 100n
SYMATTR SpiceLine Rser=300m Lser=3n Rpar=4.4meg Cpar=1p
SYMBOL Opamps\\opamp2 992 2560 R0
SYMATTR InstName U18
SYMATTR Value ne5532
SYMBOL cap 1072 2528 R0
SYMATTR InstName C40
SYMATTR Value 100n
SYMATTR SpiceLine Rser=300m Lser=3n Rpar=4.4meg Cpar=1p
SYMBOL res 48 2608 R90
WINDOW 0 0 56 VBottom 2
WINDOW 3 32 56 VTop 2
SYMATTR InstName R30
SYMATTR Value {rpre}
SYMBOL res 432 2608 R90
WINDOW 0 0 56 VBottom 2
WINDOW 3 32 56 VTop 2
SYMATTR InstName R31
SYMATTR Value {rpre}
SYMBOL res 816 2608 R90
WINDOW 0 0 56 VBottom 2
WINDOW 3 32 56 VTop 2
SYMATTR InstName R32
SYMATTR Value {rpre}
SYMBOL res 1200 2608 R90
WINDOW 0 0 56 VBottom 2
WINDOW 3 32 56 VTop 2
SYMATTR InstName R33
SYMATTR Value {rpre}
TEXT -144 336 Left 2 !;op
TEXT -848 480 Left 2 !.option plotwinsize=0
TEXT -848 512 Left 2 !.option noopiter
TEXT -848 208 Left 2 ;Transient
TEXT -848 368 Left 2 !.four {freq} 10 10 v(SPK+,SPK-)
TEXT -144 304 Left 2 !.param prb=0
TEXT -848 304 Left 2 !.param timestep {1/((262144/8)*freq)}
TEXT -848 272 Left 2 !.param freq 20k
TEXT -848 336 Left 2 !.param stoptime {iterations/freq}
TEXT -144 240 Left 2 !;ac oct 100 10 100meg
TEXT -144 272 Left 2 ;.step param prb list -1 1
TEXT -144 208 Left 2 ;AC analysis
TEXT -848 400 Left 2 !.param iterations 80
TEXT -512 544 Left 2 !.lib usr/TXN_IC.lib
TEXT -144 544 Left 2 !.param Zimp 32
TEXT 1264 640 Left 2 !.param Zreal Zimp/sqrt(2)
TEXT 1264 672 Left 2 !.param Zimg (Zimp/sqrt(2))/(2*pi*freq)
TEXT -144 576 Left 2 !.param supplyPWR 100
TEXT -144 608 Left 2 !.param supplyVLT 12
TEXT -512 608 Left 2 !.lib usr/STM_D.lib
TEXT -512 512 Left 2 !.lib usr/FCS_BJT.lib
TEXT -144 512 Left 2 !.param voutput 8
TEXT -144 640 Left 2 !.param supplyK 0.08
TEXT 1904 2112 Left 2 !.param rser {(supplyVLT*supplyVLT*supplyK)/supplyPWR}
TEXT -848 240 Left 2 !.tran 0 {stoptime} 0 {timestep} startup
TEXT 1904 2144 Left 2 !.param phi 90
TEXT 208 512 Left 2 !.param con1_len 10
TEXT 1904 2080 Left 2 !KCON1 LVCC1 LSGND1 LGSPK1 LPGND1 LPWRGND1 LPWRGND2 LVEE1 LDGND1 0.8
TEXT 208 544 Left 2 !.param con2_len 10
TEXT 1264 608 Left 2 !KCON2 LSPKP1 LSPKN1 0.8
TEXT 1264 208 Left 2 ;Konektor zvucnika i zvucnik
TEXT 1920 208 Left 2 ;Konektor napajanja, star ground i napajanje
TEXT 560 208 Left 2 ;Negativna povratna sprega
TEXT -144 480 Left 2 ;Ulazni parametri kola
TEXT 1728 752 Center 2 ;AC sonda
TEXT -512 480 Left 2 !.lib usr/FCS_D.lib
TEXT 560 640 Left 2 !.param knfb 1p
TEXT 560 672 Left 2 !.param vinput voutput*(nfb1/nfb2)
TEXT 208 608 Left 2 !.param nfb1 220
TEXT 208 640 Left 2 !.param nfb2 510
TEXT 1520 2336 Left 2 !.param rpre 51
RECTANGLE Normal -192 192 -864 432
RECTANGLE Normal -192 672 -864 464
RECTANGLE Normal 512 192 -160 432
RECTANGLE Normal 1856 704 1248 192 2
RECTANGLE Normal 1856 1248 1600 736 2
RECTANGLE Normal 2256 1008 2032 240 2
RECTANGLE Normal 1648 544 1424 240 2
RECTANGLE Normal 1216 704 544 192 2
RECTANGLE Normal 512 464 -160 672
RECTANGLE Normal 2976 2176 1888 192 2

The netlist it stands for:
* micro.asc
V1 N029 0 SINE(0 {supplyVLT*sqrt(2)*(supplyK+1)} 50 1m 0 {phi}) Rser={rser}
Ii xp x 0 AC {u(prb)}
Vi x AC2 0 AC {u(-prb)}
R2 N027 sinus {nfb1}
R3 N028 sgnd {nfb2}
V2 x AC1 0
V3 0 N030 SINE(0 {supplyVLT*sqrt(2)*(supplyK+1)} 50 1m 0 {phi}) Rser={rser}
R12 SPK+ N006 {Zreal}
L1 N006 SPK- {Zimg} Cpar=10p
V4 xp pwrgnd 0
C1 vcc pwrgnd 100n Rser=300m Lser=3n Rpar=4.4meg Cpar=1p
LVCC1 vcc N002 {con1_len*20n} Rser={con1_len*.5m}
LVEE1 vee N017 {con1_len*20n} Rser={con1_len*.5m}
V5 sinus sgnd SINE(0 {vinput} {freq} 0 0 0)
LGSPK1 gspk N007 {con1_len*20n} Rser={con1_len*.5m}
LPWRGND1 pwrgnd N014 {con1_len*20n} Rser={con1_len*.5m}
LPGND1 pgnd N010 {con1_len*20n} Rser={con1_len*.5m}
LSGND1 sgnd N004 {con1_len*20n} Rser={con1_len*.5m}
R14 N003 N002 25m
R15 N008 N007 25m
R16 N013 N014 25m
R17 N011 N010 25m
R18 N005 N004 25m
R19 N018 N017 25m
L2 N013 0 2n Rser=1m
L3 N011 N013 2n Rser=1m
L4 N008 N011 2n Rser=1m
L5 N005 N008 2n Rser=1m
LSPKP1 SPKP N001 {con2_len*20n} Rser={con2_len*.5m}
LSPKN1 gspk N009 {con2_len*20n} Rser={con2_len*.5m}
R21 SPK+ N001 15m
R22 SPK- N009 15m
LDGND1 pwrgnd N015 {con1_len*20n} Rser={con1_len*.5m}
R23 N013 N015 25m
LPWRGND2 pwrgnd N012 {con1_len*20n} Rser={con1_len*.5m}
R24 N013 N012 25m
V6 N023 sgnd PULSE(0 {vinput/2} 1u 1n 1n {1/(freq*2)} {1/freq})
V7 impulse N023 PULSE(0 {-vinput/2} {1u+(1/(freq*2))} 1n 1n {1/(freq*2)} {1/freq})
C4 N027 N028 220µ V=6.3 Irms=290m Rser=0.5 Lser=3n Rpar=2100k Cpar=3p mfg="Nichicon" pn="UPW0J221MED1TD" type="Al electrolytic"
C5 vcc pwrgnd 2.2m V=63 Irms=2.77 Rser=0.036 Lser=12n Rpar=900k Cpar=3p
C6 pwrgnd vee 2.2m V=63 Irms=2.77 Rser=0.038 Lser=12n Rpar=800k Cpar=3p
V8 vpreout AC1 0
V9 SPKP AC2 0
V10 N024 sgnd SINE(0 {vinput/2} 19k)
V11 imd N024 SINE(0 {vinput/2} 20k 0 0)
C7 N030 0 100n Rser=700m Lser=7n Rpar=4.4meg Cpar=1p
C12 0 N018 47m V=50 Irms=2.5 Rser=0.024 Lser=89n Rpar=40k Cpar=3p
C13 N003 0 47m V=50 Irms=2.5 Rser=0.024 Lser=85n Rpar=40k Cpar=3p
R38 0 N018 10k
R39 N003 0 10k
C14 0 N018 47m V=50 Irms=2.5 Rser=0.024 Lser=89n Rpar=40k Cpar=3p
C15 N003 0 47m V=50 Irms=2.5 Rser=0.024 Lser=85n Rpar=40k Cpar=3p
D2 N030 N003 GBPC3502
D3 N018 N029 GBPC3502
D4 N029 N003 GBPC3502
D5 N018 N030 GBPC3502
C16 N018 N029 100n Rser=700m Lser=7n Rpar=4.4meg Cpar=1p
C17 N018 N030 100n Rser=700m Lser=7n Rpar=4.4meg Cpar=1p
C18 N003 N029 100n Rser=700m Lser=7n Rpar=4.4meg Cpar=1p
C19 N003 N030 100n Rser=700m Lser=7n Rpar=4.4meg Cpar=1p
C20 0 N029 100n Rser=700m Lser=7n Rpar=4.4meg Cpar=1p
C21 N030 N029 100n Rser=700m Lser=7n Rpar=4.4meg Cpar=1p
C22 sgnd N028 2n2 Rser=.15 Lser=5n Rpar=3meg Cpar=2p
R41 sinus sgnd 10k
C24 0 N018 47m V=50 Irms=2.5 Rser=0.024 Lser=89n Rpar=40k Cpar=3p
C25 N003 0 47m V=50 Irms=2.5 Rser=0.024 Lser=85n Rpar=40k Cpar=3p
C26 vee pwrgnd 100n Rser=300m Lser=3n Rpar=4.4meg Cpar=1p
C27 vee pwrgnd 22µ Rser=80m Lser=6n Rpar=4.4meg Cpar=1p
C28 vcc pwrgnd 22µ Rser=80m Lser=6n Rpar=4.4meg Cpar=1p
V12 stability N016 SINE(0 {7*vinput/8} {freq} 0 0 0)
V13 N016 N025 PULSE(0 {-vinput/8} {1u+(1/(freq*80))} 1n 1n {1/(freq*80)} {1/(freq*40)})
V14 N025 sgnd PULSE(0 {vinput/8} 1u 1n 1n {1/(freq*80)} {1/(freq*40)})
XU1 N028 N026 vcc vee voin ne5532  ; pins In+ In- V+ V- OUT
XU5 voin N019 vcc vee N019 ne5532  ; pins In+ In- V+ V- OUT
C23 vcc vee 100n Rser=300m Lser=3n Rpar=4.4meg Cpar=1p
R7 vpreout N019 {rpre}
C33 vcc vee 100n Rser=300m Lser=3n Rpar=4.4meg Cpar=1p
XU2 voin N020 vcc vee N020 ne5532  ; pins In+ In- V+ V- OUT
C8 vcc vee 100n Rser=300m Lser=3n Rpar=4.4meg Cpar=1p
XU3 voin N021 vcc vee N021 ne5532  ; pins In+ In- V+ V- OUT
C9 vcc vee 100n Rser=300m Lser=3n Rpar=4.4meg Cpar=1p
XU4 voin N022 vcc vee N022 ne5532  ; pins In+ In- V+ V- OUT
C11 vcc vee 100n Rser=300m Lser=3n Rpar=4.4meg Cpar=1p
XU6 voin N031 vcc vee N031 ne5532  ; pins In+ In- V+ V- OUT
C29 vcc vee 100n Rser=300m Lser=3n Rpar=4.4meg Cpar=1p
XU7 voin N032 vcc vee N032 ne5532  ; pins In+ In- V+ V- OUT
C30 vcc vee 100n Rser=300m Lser=3n Rpar=4.4meg Cpar=1p
XU8 voin N033 vcc vee N033 ne5532  ; pins In+ In- V+ V- OUT
C31 vcc vee 100n Rser=300m Lser=3n Rpar=4.4meg Cpar=1p
XU9 voin N034 vcc vee N034 ne5532  ; pins In+ In- V+ V- OUT
C32 vcc vee 100n Rser=300m Lser=3n Rpar=4.4meg Cpar=1p
XU10 voin N035 vcc vee N035 ne5532  ; pins In+ In- V+ V- OUT
C35 vcc vee 100n Rser=300m Lser=3n Rpar=4.4meg Cpar=1p
R4 vpreout N020 {rpre}
R5 vpreout N021 {rpre}
R6 vpreout N022 {rpre}
R8 vpreout N031 {rpre}
R13 vpreout N032 {rpre}
R26 vpreout N035 {rpre}
R27 vpreout N033 {rpre}
R29 vpreout N034 {rpre}
R1 SPKP N026 {nfb2}
R10 N026 sgnd {nfb1}
C2 N026 voin 100p
R9 vpreout voin {rpre}
XU11 voin N036 vcc vee N036 ne5532  ; pins In+ In- V+ V- OUT
C3 vcc vee 100n Rser=300m Lser=3n Rpar=4.4meg Cpar=1p
XU12 voin N037 vcc vee N037 ne5532  ; pins In+ In- V+ V- OUT
C10 vcc vee 100n Rser=300m Lser=3n Rpar=4.4meg Cpar=1p
XU13 voin N038 vcc vee N038 ne5532  ; pins In+ In- V+ V- OUT
C34 vcc vee 100n Rser=300m Lser=3n Rpar=4.4meg Cpar=1p
XU14 voin N039 vcc vee N039 ne5532  ; pins In+ In- V+ V- OUT
C36 vcc vee 100n Rser=300m Lser=3n Rpar=4.4meg Cpar=1p
R11 vpreout N036 {rpre}
R20 vpreout N037 {rpre}
R25 vpreout N038 {rpre}
R28 vpreout N039 {rpre}
XU15 voin N040 vcc vee N040 ne5532  ; pins In+ In- V+ V- OUT
C37 vcc vee 100n Rser=300m Lser=3n Rpar=4.4meg Cpar=1p
XU16 voin N041 vcc vee N041 ne5532  ; pins In+ In- V+ V- OUT
C38 vcc vee 100n Rser=300m Lser=3n Rpar=4.4meg Cpar=1p
XU17 voin N042 vcc vee N042 ne5532  ; pins In+ In- V+ V- OUT
C39 vcc vee 100n Rser=300m Lser=3n Rpar=4.4meg Cpar=1p
XU18 voin N043 vcc vee N043 ne5532  ; pins In+ In- V+ V- OUT
C40 vcc vee 100n Rser=300m Lser=3n Rpar=4.4meg Cpar=1p
R30 vpreout N040 {rpre}
R31 vpreout N041 {rpre}
R32 vpreout N042 {rpre}
R33 vpreout N043 {rpre}
.model D D
.lib standard.dio
;op
.option plotwinsize=0
.option noopiter
* Transient
.four {freq} 10 10 v(SPK+,SPK-)
.param prb=0
.param timestep {1/((262144/8)*freq)}
.param freq 20k
.param stoptime {iterations/freq}
;ac oct 100 10 100meg
* .step param prb list -1 1
* AC analysis
.param iterations 80
.lib usr/TXN_IC.lib
.param Zimp 32
.param Zreal Zimp/sqrt(2)
.param Zimg (Zimp/sqrt(2))/(2*pi*freq)
.param supplyPWR 100
.param supplyVLT 12
.lib usr/STM_D.lib
.lib usr/FCS_BJT.lib
.param voutput 8
.param supplyK 0.08
.param rser {(supplyVLT*supplyVLT*supplyK)/supplyPWR}
.tran 0 {stoptime} 0 {timestep} startup
.param phi 90
.param con1_len 10
KCON1 LVCC1 LSGND1 LGSPK1 LPGND1 LPWRGND1 LPWRGND2 LVEE1 LDGND1 0.8
.param con2_len 10
KCON2 LSPKP1 LSPKN1 0.8
* Konektor zvucnika i zvucnik
* Konektor napajanja, star ground i napajanje
* Negativna povratna sprega
* Ulazni parametri kola
* AC sonda
.lib usr/FCS_D.lib
.param knfb 1p
.param vinput voutput*(nfb1/nfb2)
.param nfb1 220
.param nfb2 510
.param rpre 51
.backanno
.end